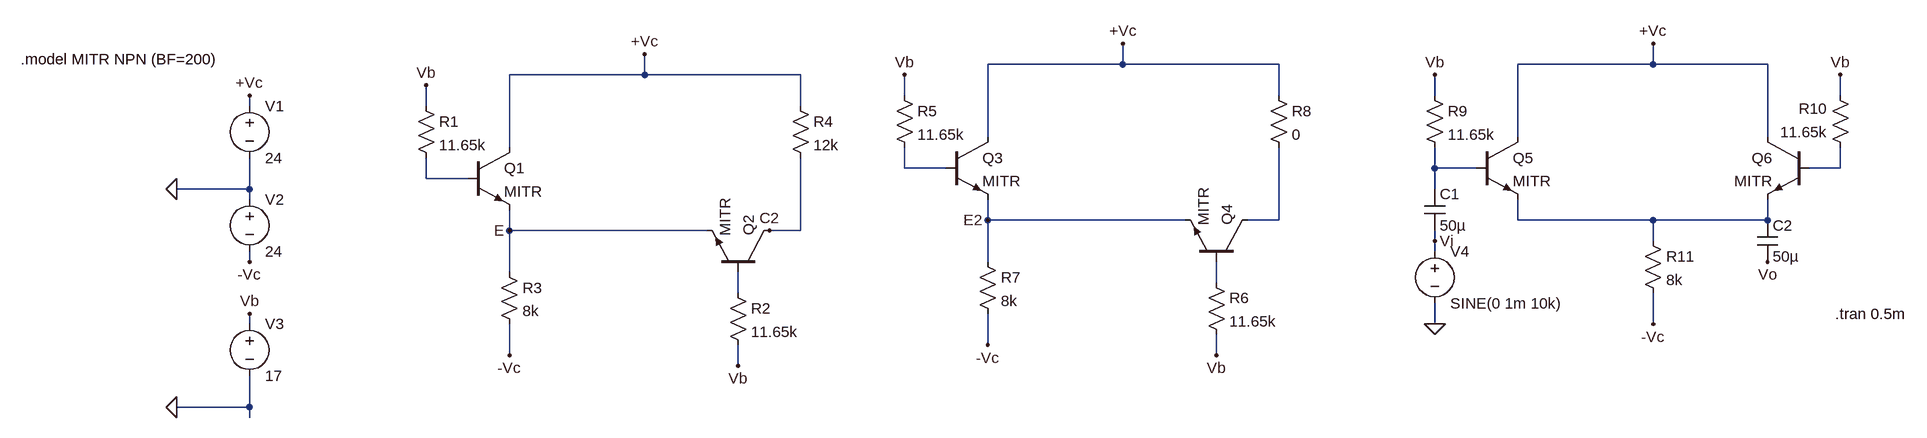
[diagram p0: schematic Ej#2_h.asc]
Ej#2_h.asc, the LTspice schematic file:
Version 4
SHEET 1 2772 724
WIRE 1552 80 1552 48
WIRE 1552 80 1344 80
WIRE 1792 80 1552 80
WIRE 2368 80 2368 48
WIRE 2368 80 2160 80
WIRE 2544 80 2368 80
WIRE 816 96 816 64
WIRE 816 96 608 96
WIRE 1056 96 816 96
WIRE 1216 128 1216 96
WIRE 1792 128 1792 80
WIRE 2032 128 2032 96
WIRE 2656 128 2656 96
WIRE 208 144 208 128
WIRE 480 144 480 112
WIRE 1056 144 1056 96
WIRE 1344 192 1344 80
WIRE 2160 192 2160 80
WIRE 2544 192 2544 80
WIRE 608 208 608 96
WIRE 1216 240 1216 208
WIRE 1280 240 1216 240
WIRE 2032 240 2032 208
WIRE 2096 240 2032 240
WIRE 2656 240 2656 208
WIRE 2656 240 2608 240
WIRE 480 256 480 224
WIRE 544 256 480 256
WIRE 208 272 208 224
WIRE 208 272 96 272
WIRE 2032 272 2032 240
WIRE 208 288 208 272
WIRE 1344 320 1344 288
WIRE 1648 320 1344 320
WIRE 1792 320 1792 208
WIRE 1792 320 1744 320
WIRE 2160 320 2160 288
WIRE 2368 320 2160 320
WIRE 2544 320 2544 288
WIRE 2544 320 2368 320
WIRE 608 336 608 304
WIRE 912 336 608 336
WIRE 1056 336 1056 224
WIRE 1056 336 1008 336
WIRE 2032 352 2032 336
WIRE 2368 352 2368 320
WIRE 2032 368 2032 352
WIRE 208 384 208 368
WIRE 1344 384 1344 320
WIRE 608 400 608 336
WIRE 1696 416 1696 384
WIRE 960 432 960 400
WIRE 208 480 208 464
WIRE 2032 480 2032 448
WIRE 2368 480 2368 432
WIRE 1344 512 1344 464
WIRE 608 528 608 480
WIRE 1696 528 1696 496
WIRE 960 544 960 512
WIRE 208 608 208 560
WIRE 208 608 96 608
WIRE 208 624 208 608
FLAG 96 272 0
FLAG 96 608 0
FLAG 208 128 +Vc
FLAG 816 64 +Vc
FLAG 208 384 -Vc
FLAG 608 528 -Vc
FLAG 208 464 Vb
FLAG 480 112 Vb
FLAG 960 544 Vb
FLAG 608 336 E
FLAG 1008 336 C2
FLAG 1552 48 +Vc
FLAG 1344 512 -Vc
FLAG 1216 96 Vb
FLAG 1696 528 Vb
FLAG 1344 320 E2
FLAG 2368 48 +Vc
FLAG 2368 480 -Vc
FLAG 2032 96 Vb
FLAG 2656 96 Vb
FLAG 2032 480 0
FLAG 2544 384 Vo
FLAG 2032 352 Vi
SYMBOL voltage 208 128 R0
WINDOW 123 0 0 Left 0
WINDOW 39 0 0 Left 0
SYMATTR InstName V1
SYMATTR Value 24
SYMBOL voltage 208 272 R0
WINDOW 123 0 0 Left 0
WINDOW 39 0 0 Left 0
SYMATTR InstName V2
SYMATTR Value 24
SYMBOL npn 544 208 R0
SYMATTR InstName Q1
SYMATTR Value MITR
SYMBOL npn 1008 400 M270
SYMATTR InstName Q2
SYMATTR Value MITR
SYMBOL voltage 208 464 R0
WINDOW 123 0 0 Left 0
WINDOW 39 0 0 Left 0
SYMATTR InstName V3
SYMATTR Value 17
SYMBOL res 464 128 R0
SYMATTR InstName R1
SYMATTR Value 11.65k
SYMBOL res 944 416 R0
SYMATTR InstName R2
SYMATTR Value 11.65k
SYMBOL res 592 384 R0
SYMATTR InstName R3
SYMATTR Value 8k
SYMBOL res 1040 128 R0
SYMATTR InstName R4
SYMATTR Value 12k
SYMBOL npn 1280 192 R0
SYMATTR InstName Q3
SYMATTR Value MITR
SYMBOL npn 1744 384 M270
SYMATTR InstName Q4
SYMATTR Value MITR
SYMBOL res 1200 112 R0
SYMATTR InstName R5
SYMATTR Value 11.65k
SYMBOL res 1680 400 R0
SYMATTR InstName R6
SYMATTR Value 11.65k
SYMBOL res 1328 368 R0
SYMATTR InstName R7
SYMATTR Value 8k
SYMBOL res 1776 112 R0
SYMATTR InstName R8
SYMATTR Value 0
SYMBOL npn 2096 192 R0
SYMATTR InstName Q5
SYMATTR Value MITR
SYMBOL npn 2608 192 M0
SYMATTR InstName Q6
SYMATTR Value MITR
SYMBOL res 2016 112 R0
SYMATTR InstName R9
SYMATTR Value 11.65k
SYMBOL res 2672 224 R180
WINDOW 0 36 76 Left 2
WINDOW 3 36 40 Left 2
SYMATTR InstName R10
SYMATTR Value 11.65k
SYMBOL res 2352 336 R0
SYMATTR InstName R11
SYMATTR Value 8k
SYMBOL cap 2016 272 R0
SYMATTR InstName C1
SYMATTR Value 50µ
SYMBOL voltage 2032 352 R0
WINDOW 123 0 0 Left 0
WINDOW 39 0 0 Left 0
SYMATTR InstName V4
SYMATTR Value SINE(0 1m 10k)
SYMBOL cap 2528 320 R0
SYMATTR InstName C2
SYMATTR Value 50µ
TEXT -144 72 Left 2 !.model MITR NPN (BF=200)
TEXT 2648 464 Left 2 !.tran 0.5m

The netlist it stands for:
* Ej#2_h.asc
V1 +Vc 0 24
V2 0 -Vc 24
Q1 +Vc N004 E 0 MITR
Q2 C2 N008 E 0 MITR
V3 Vb 0 17
R1 Vb N004 11.65k
R2 N008 Vb 11.65k
R3 E -Vc 8k
R4 +Vc C2 12k
Q3 +Vc N001 E2 0 MITR
Q4 N005 N007 E2 0 MITR
R5 Vb N001 11.65k
R6 N007 Vb 11.65k
R7 E2 -Vc 8k
R8 +Vc N005 0
Q5 +Vc N002 N006 0 MITR
Q6 +Vc N003 N006 0 MITR
R9 Vb N002 11.65k
R10 N003 Vb 11.65k
R11 N006 -Vc 8k
C1 N002 Vi 50µ
V4 Vi 0 SINE(0 1m 10k)
C2 N006 Vo 50µ
.model NPN NPN
.model PNP PNP
.lib standard.bjt
.model MITR NPN (BF=200)
.tran 0.5m
.backanno
.end